# Altium schematic sheet 3_imu.SchDoc: Teseu - IMU
size A4; DocumentNumber: 4; Revision: 0.1; SheetNumber: 4; SheetTotal: 6
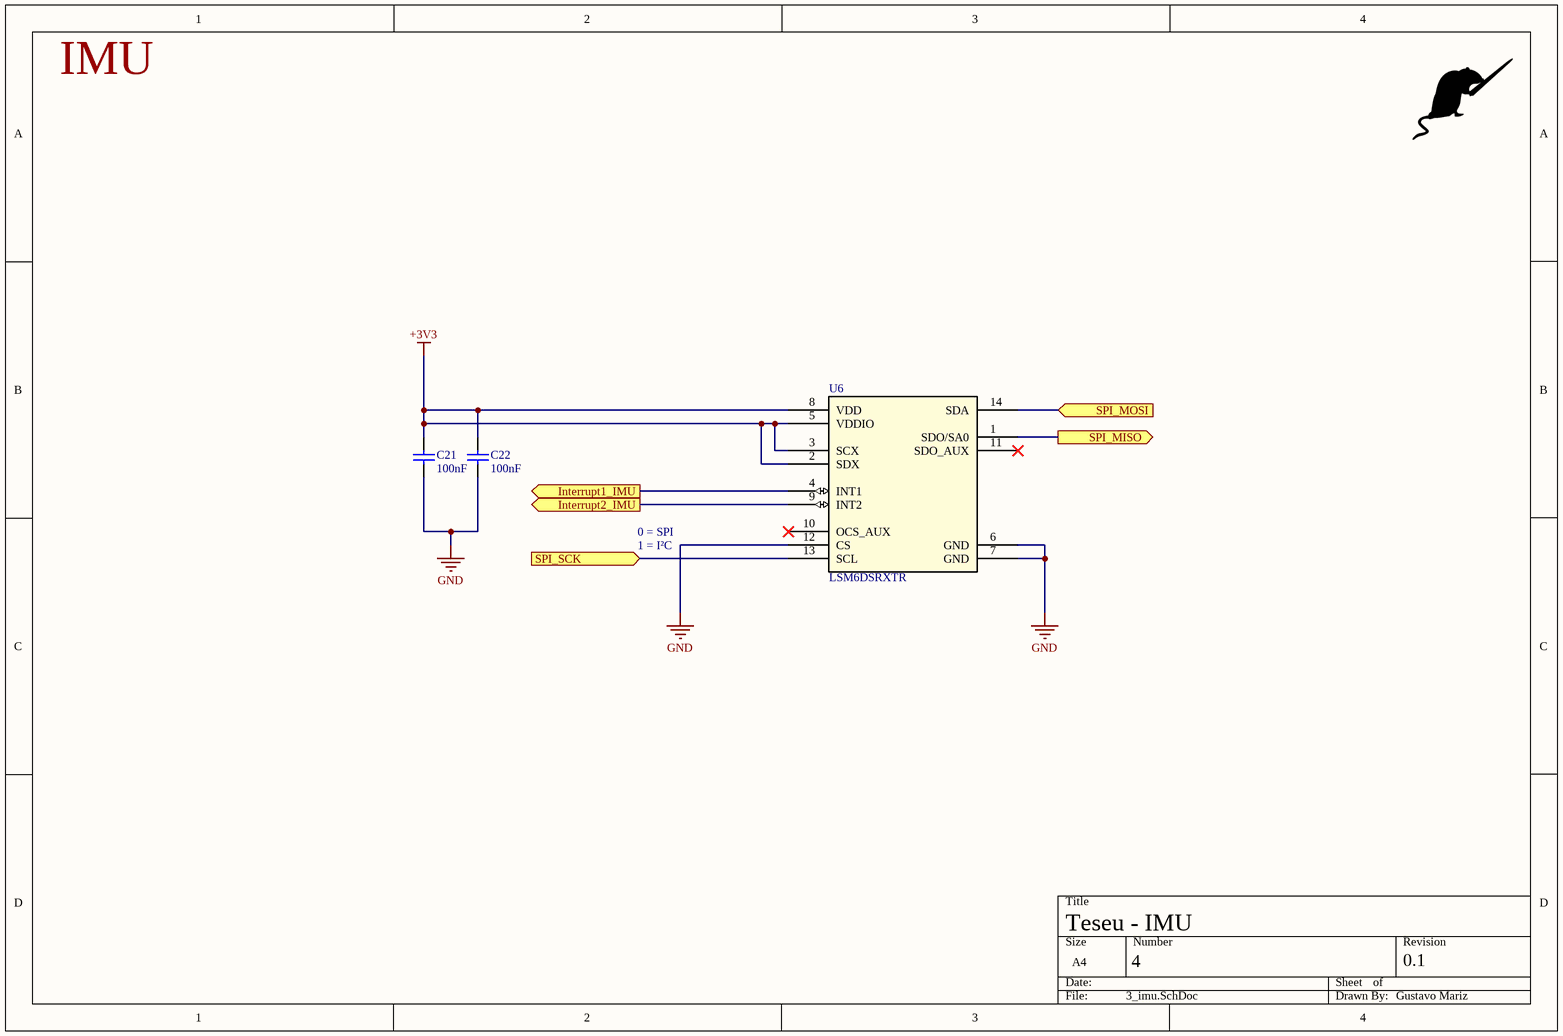
[diagram p0: 3_imu.SchDoc]

## Parts
C21  Valor: 100nF  [0603]  (hidden comment: CAP)
C22  Valor: 100nF  [0603]  (hidden comment: CAP)
U6  LSM6DSRXTR  [LGA-14L_STM]

## Ports
Interrupt1_IMU (out, see 1_micro[2B]), Interrupt2_IMU (out, see 1_micro[2B]), SPI_MISO (out, see 1_micro[2A]), SPI_MOSI (in, see 1_micro[2A]), SPI_SCK (in, see 1_micro[2A])

## Nets
+3V3: C21.2 C22.2 U6.2(SDX) U6.3(SCX) U6.5(VDDIO) U6.8(VDD)
GND: C21.1 C22.1 U6.6(GND) U6.7(GND) U6.12(CS)
Interrupt1_IMU: U6.4(INT1) ; port Interrupt1_IMU
Interrupt2_IMU: U6.9(INT2) ; port Interrupt2_IMU
SPI_MISO: U6.1(SDO/SA0) ; port SPI_MISO
SPI_MOSI: U6.14(SDA) ; port SPI_MOSI
SPI_SCK: U6.13(SCL) ; port SPI_SCK

Not connected (* = marked no-connect by the designer): U6 10(OCS_AUX)* 11(SDO_AUX)*

## Notes on the sheet
- IMU
- 0 = SPI
- 1 = I²C
- Gustavo Mariz

## Library data of the parts
C21 C22 = CAP. CERÂMICO: Capacitor; Criador por: Luigi Eduardo; Pertence a: Trincabotz; Criado em: 26/06/2012
U6 = LSM6DSRXTR: No Description Available; Mfr_Name: STMicroelectronics; RefDes: RefDes; Type: Type